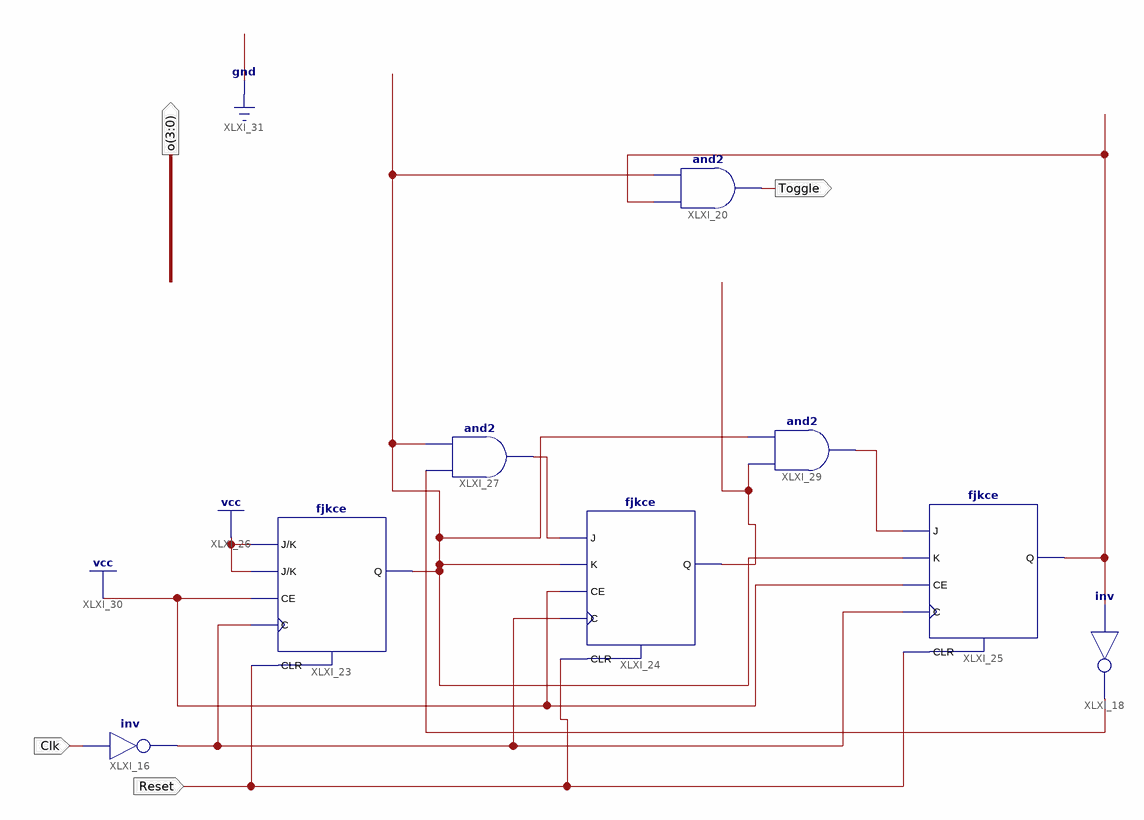
[diagram p0: schematic sheet 1]
// Xilinx ISE schematic Counter0_5C.sch (spartan6) as structural Verilog: 8 symbols, 4 ports
module Counter0_5C (
  input  Clk,
  input  Reset,
  output Toggle,
  output [3:0] o
);

  wire XLXN_30, XLXN_37, XLXN_38, XLXN_39;

  not XLXI_16 (XLXN_37, Clk);
  not XLXI_18 (XLXN_38, o[2]);
  and XLXI_20 (Toggle, o[2], o[0]);
  fjkce XLXI_23 (.C(XLXN_37), .CE(1'b1), .CLR(Reset), .J(1'b1), .K(1'b1), .Q(o[0]));
  fjkce XLXI_24 (.C(XLXN_37), .CE(1'b1), .CLR(Reset), .J(XLXN_30), .K(o[0]), .Q(o[1]));
  fjkce XLXI_25 (.C(XLXN_37), .CE(1'b1), .CLR(Reset), .J(XLXN_39), .K(o[0]), .Q(o[2]));
  and XLXI_27 (XLXN_30, XLXN_38, o[0]);
  and XLXI_29 (XLXN_39, o[1], o[0]);
endmodule
